# Altium schematic sheet 01. Main.SchDoc
size A3; CheckedBy: 黄钦宁; Author: 陈坤; DocumentNumber: 1; SheetNumber: 1; SheetTotal: 13; PageSetup: Record=PageOptions|CenterHorizontal=True|CenterVertical=True|PrintScale=1.00|XCorrection=1.00|YCorrection=1.00|PrintKind=0|BorderSize=5000000|LeftOffset=0|BottomOffset=0|Orientation=2|PaperLength=1000|PaperWidth=1000|Scale=100|PaperSource=7|PrintQuality=600|MediaType=1|DitherType=10|PaperKind=A4|PrintScaleMode=1; DesignDate: 2013-08-16; CheckDate: 2013-12-28; SheetName: Main; SheetVersion: V1.01; SheetDescription: EasyARM-iMX283评估底板; ModifiedDate1: 2013-11-30; ModifiedDate2: 2013-11-30; ModifiedContent1: 将悬空的引脚引到排针上; ModifiedContent2: 删除纽扣电池电路，增加锂电池插座; ProductName: EasyARM-iMX28学习套件; ProductModel: EasyARM-iMX283
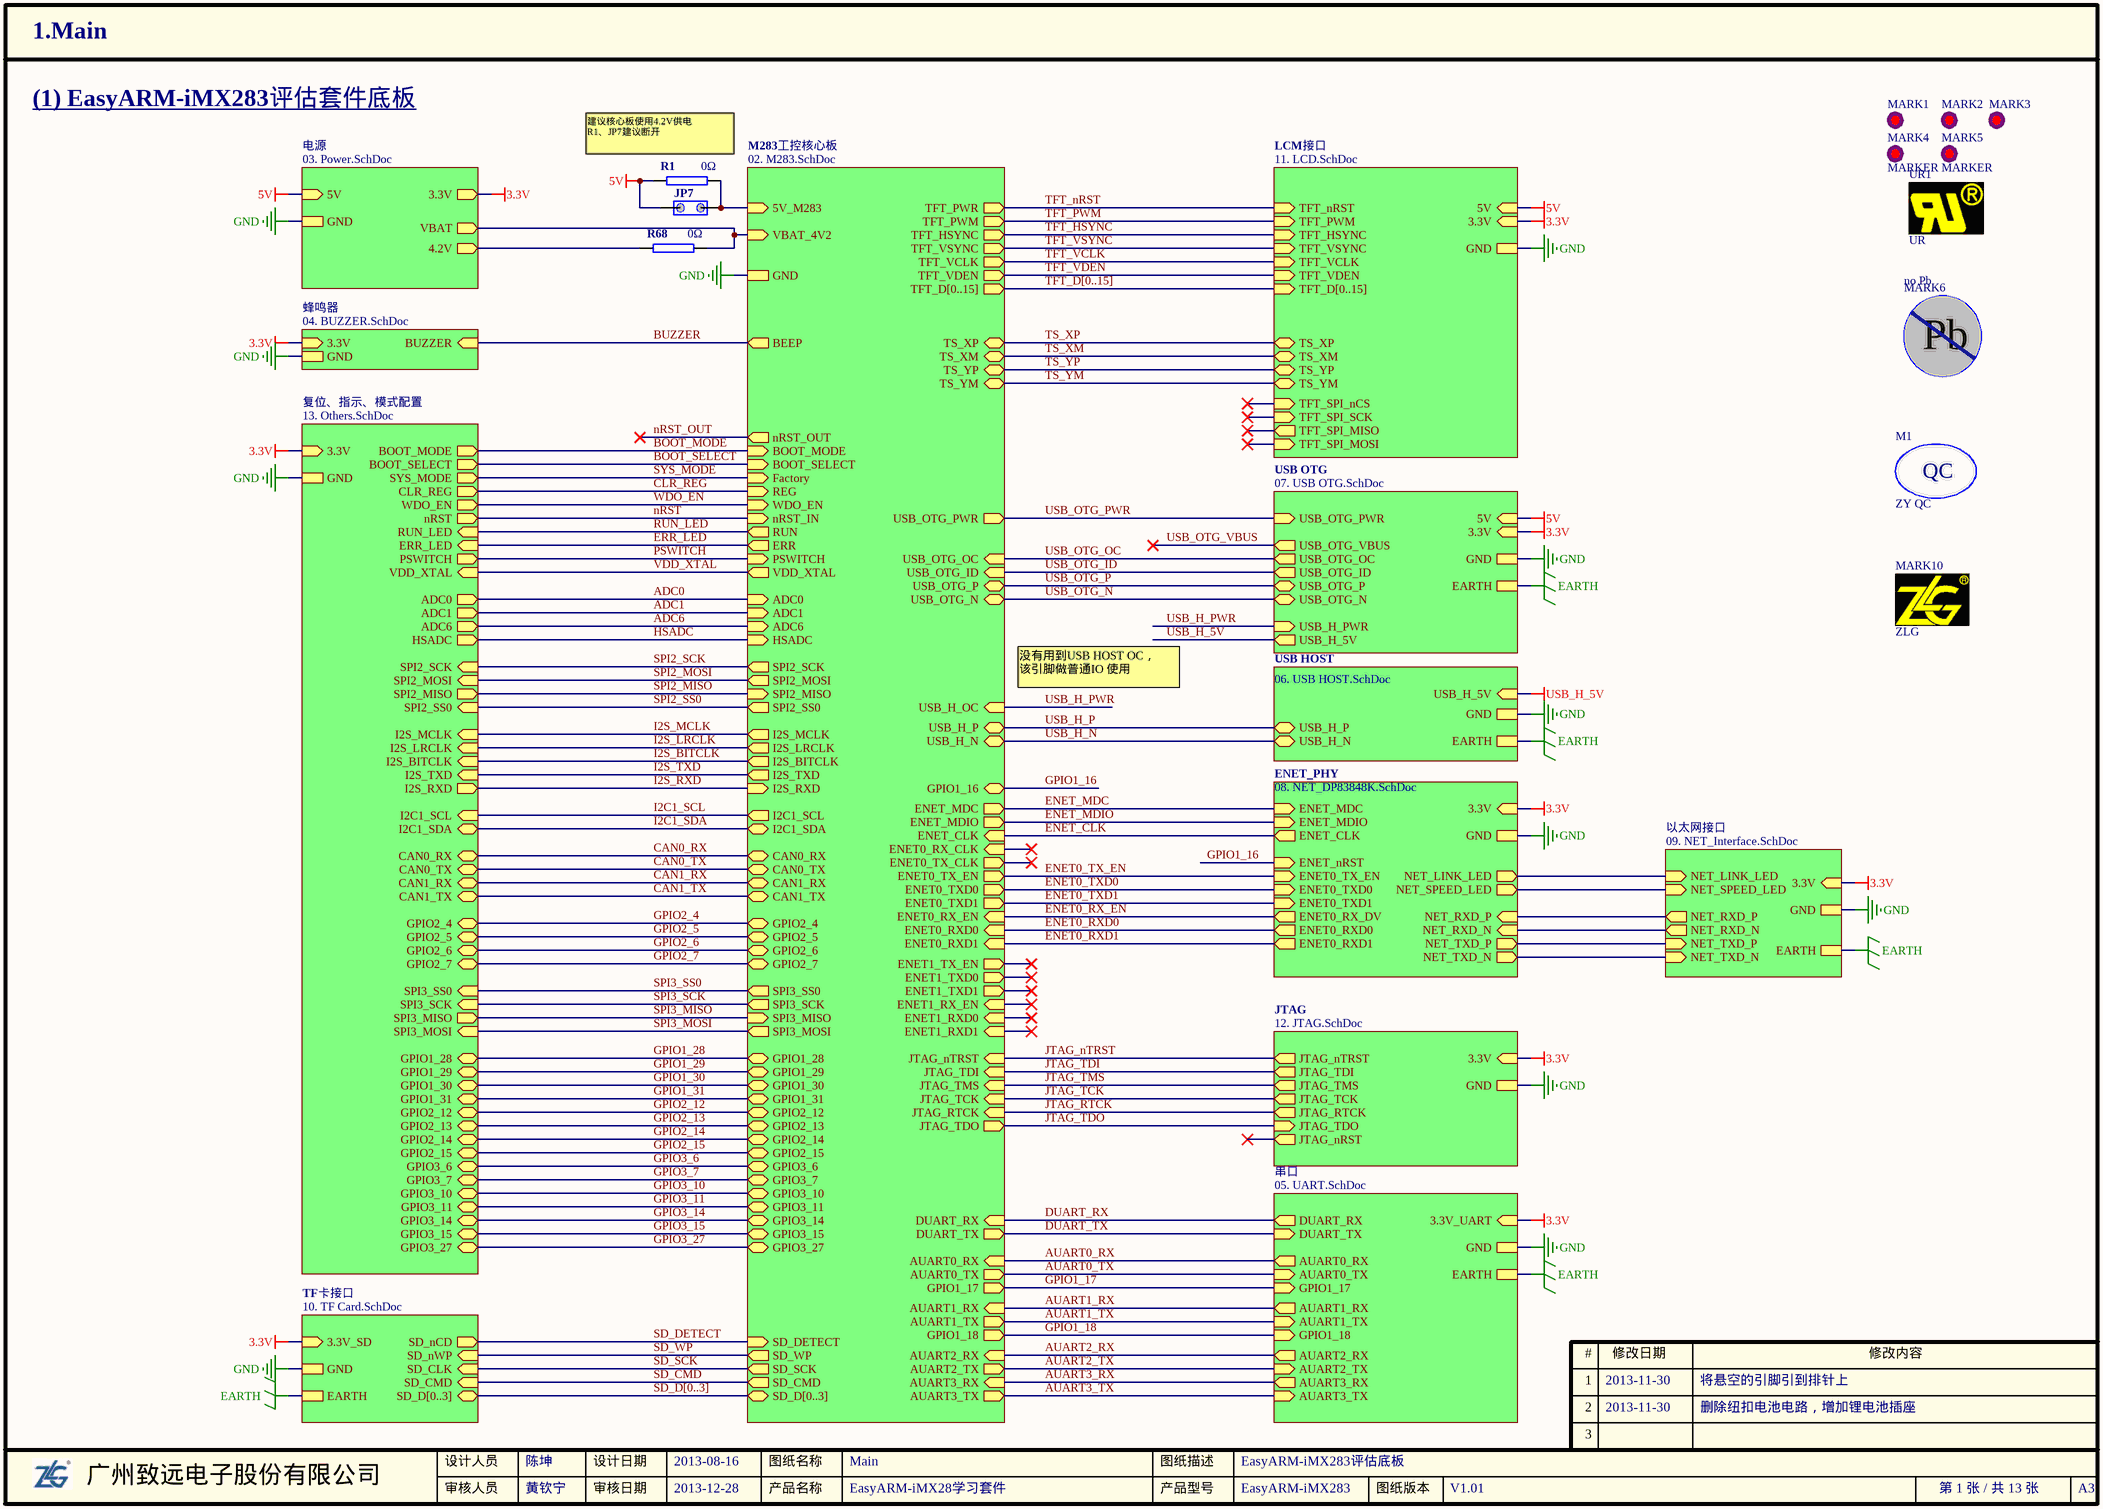
[diagram p0: 01. Main.SchDoc]

## Parts
JP7  120Ω_EN  [SIP-2]  (value not drawn)
M1  ZY QC  [ZY_QC]  (no BOM)
MARK1  MARKER  [MARKER-C]  (value not drawn)
MARK2  MARKER  [MARKER-C]  (value not drawn)
MARK3  MARKER  [MARKER-C]  (value not drawn)
MARK4  MARKER  [MARKER-C]
MARK5  MARKER  [MARKER-C]
MARK6  no Pb  [ZY_no Pb-4]
MARK10  ZLG  [ZLG0.7]  (no BOM)
R1  0Ω  [0603R]
R68  0Ω  [0603R]
UR1  UR  [ZY_UR-3X2]

## Sub-sheets
ENET_PHY = 08. NET_DP83848K.SchDoc: 3.3V, NET_LINK_LED (out), NET_SPEED_LED (out), NET_RXD_P (in), NET_RXD_N (in), GND, NET_TXD_P (out), NET_TXD_N (out), ENET_nRST (in), ENET_MDC (in), ENET_MDIO (in), ENET0_TX_EN (in), ENET0_RX_DV (out), ENET_CLK (out), ENET0_TXD0 (in), ENET0_TXD1 (in), ENET0_RXD0 (out), ENET0_RXD1 (out)
JTAG = 12. JTAG.SchDoc: 3.3V, GND, JTAG_nTRST (out), JTAG_TDI (out), JTAG_TMS (out), JTAG_TCK (out), JTAG_RTCK (out), JTAG_TDO (in), JTAG_nRST (out)
LCM接口 = 11. LCD.SchDoc: 5V, 3.3V, GND, TS_XP (bidir), TS_XM (bidir), TS_YP (bidir), TS_YM (bidir), TFT_D[0..15] (in), TFT_PWM (in), TFT_HSYNC (in), TFT_VSYNC (in), TFT_VCLK (in), TFT_VDEN (in), TFT_SPI_MISO (out), TFT_SPI_MOSI (in), TFT_SPI_nCS (in), TFT_SPI_SCK (in), TFT_nRST (in)
M283工控核心板 = 02. M283.SchDoc: 5V_M283, GND, Factory (in), BOOT_MODE (in), BOOT_SELECT (in), WDO_EN (in), nRST_IN (in), nRST_OUT (out), RUN (out), ERR (out), BEEP (out), SD_DETECT (in), SD_SCK (out), SD_WP (out), SD_D[0..3] (bidir), SD_CMD (out), DUART_RX (in), DUART_TX (out), TFT_VSYNC (out), TFT_HSYNC (out), TFT_VCLK (out), TFT_VDEN (out), TFT_PWM (out), TFT_D[0..15] (out), TS_XP (bidir), TS_XM (bidir), TS_YP (bidir), TS_YM (bidir), ADC0 (in), ADC1 (in), ADC6 (in), HSADC (in), USB_H_N (bidir), USB_H_P (bidir), USB_OTG_OC (in), USB_OTG_ID (in), USB_OTG_P (bidir), USB_OTG_N (bidir), SPI2_MOSI (out), SPI2_MISO (in), SPI2_SCK (out), SPI2_SS0 (out), JTAG_TCK (in), JTAG_TMS (in), JTAG_TDI (in), JTAG_TDO (out), JTAG_RTCK (in), JTAG_nTRST (in), REG (in), VBAT_4V2 (in), PSWITCH (in), I2S_BITCLK (out), I2S_LRCLK (out), I2S_MCLK (out), I2S_TXD (out), I2S_RXD (in), I2C1_SCL (out), I2C1_SDA (bidir), CAN0_RX (bidir), CAN0_TX (bidir), CAN1_RX (bidir), CAN1_TX (bidir), AUART0_TX (out), AUART0_RX (in), AUART1_RX (in), AUART1_TX (out), GPIO1_17 (out), AUART2_RX (in), AUART2_TX (out), GPIO1_18 (out), AUART3_RX (in), AUART3_TX (out), USB_H_OC (in), USB_OTG_PWR (out), SPI3_MISO (in), SPI3_MOSI (out), SPI3_SCK (out), SPI3_SS0 (out), ENET_MDC (out), ENET_MDIO (out), ENET0_TX_CLK (out), ENET0_TX_EN (out), ENET0_RX_EN (in), ENET0_RX_CLK (in), VDD_XTAL (out), TFT_PWR (out), GPIO3_6 (bidir), GPIO3_7 (bidir), GPIO3_10 (bidir), GPIO3_11 (bidir), GPIO3_14 (bidir), GPIO3_15 (bidir), GPIO3_27 (bidir), GPIO2_12 (bidir), GPIO2_13 (bidir), GPIO2_14 (bidir), GPIO2_15 (bidir), ENET_CLK (in), GPIO1_28 (bidir), GPIO1_29 (bidir), GPIO1_30 (bidir), GPIO1_31 (bidir), GPIO1_16 (bidir), ENET0_TXD0 (out), ENET0_TXD1 (out), ENET0_RXD0 (in), ENET0_RXD1 (in), GPIO2_4 (bidir), GPIO2_5 (bidir), GPIO2_6 (bidir), GPIO2_7 (bidir), ENET1_TX_EN (out), ENET1_RX_EN (in), ENET1_TXD0 (out), ENET1_TXD1 (out), ENET1_RXD0 (in), ENET1_RXD1 (in)
TF卡接口 = 10. TF Card.SchDoc: 3.3V_SD, GND, SD_nCD (out), SD_nWP (in), SD_CLK (in), SD_CMD (in), EARTH, SD_D[0..3] (bidir)
USB HOST = 06. USB HOST.SchDoc: USB_H_5V, GND, USB_H_P (bidir), USB_H_N (bidir), EARTH
USB OTG = 07. USB OTG.SchDoc: 5V, GND, USB_OTG_PWR (in), USB_OTG_ID (out), USB_OTG_P (bidir), USB_OTG_N (bidir), EARTH, USB_OTG_OC (out), USB_OTG_VBUS (out), USB_H_PWR (in), USB_H_5V (out), 3.3V (in)
串口 = 05. UART.SchDoc: 3.3V_UART (in), GND, DUART_RX (out), DUART_TX (in), EARTH, AUART0_RX (out), AUART0_TX (in), AUART1_RX (out), AUART1_TX (in), GPIO1_17 (in), GPIO1_18 (in), AUART2_RX (out), AUART3_RX (out), AUART3_TX (in), AUART2_TX (in)
以太网接口 = 09. NET_Interface.SchDoc: 3.3V (in), GND, NET_LINK_LED (in), NET_SPEED_LED (in), NET_RXD_P (out), NET_RXD_N (out), EARTH, NET_TXD_P (in), NET_TXD_N (in)
复位、指示、模式配置 = 13. Others.SchDoc: 3.3V, GND, BOOT_MODE (out), BOOT_SELECT (out), SYS_MODE (out), WDO_EN (out), nRST (out), RUN_LED (in), ERR_LED (in), ADC0 (out), ADC1 (out), ADC6 (out), HSADC (out), SPI2_SCK (in), SPI2_MOSI (in), SPI2_MISO (out), SPI2_SS0 (in), CLR_REG (out), PSWITCH (out), I2S_BITCLK (in), I2S_MCLK (in), I2S_LRCLK (in), I2S_TXD (in), I2S_RXD (out), I2C1_SCL (in), I2C1_SDA (bidir), VDD_XTAL (in), GPIO2_4 (bidir), GPIO2_5 (bidir), GPIO2_6 (bidir), GPIO2_7 (bidir), CAN0_RX (bidir), CAN0_TX (bidir), CAN1_RX (bidir), CAN1_TX (bidir), SPI3_SCK (in), SPI3_MOSI (in), SPI3_MISO (out), SPI3_SS0 (in), GPIO3_6 (bidir), GPIO3_7 (bidir), GPIO3_10 (bidir), GPIO3_11 (bidir), GPIO3_14 (bidir), GPIO3_15 (bidir), GPIO3_27 (bidir), GPIO2_12 (bidir), GPIO2_13 (bidir), GPIO2_14 (bidir), GPIO2_15 (bidir), GPIO1_28 (bidir), GPIO1_29 (bidir), GPIO1_30 (bidir), GPIO1_31 (bidir)
电源 = 03. Power.SchDoc: 3.3V, GND, 5V, VBAT (out), 4.2V (out)
蜂鸣器 = 04. BUZZER.SchDoc: 3.3V (in), BUZZER (in), GND

## Nets
3.3V: sheet 串口/3.3V_UART, sheet USB OTG/3.3V, sheet 以太网接口/3.3V, sheet ENET_PHY/3.3V, sheet TF卡接口/3.3V_SD, sheet LCM接口/3.3V, sheet 电源/3.3V, sheet 复位、指示、模式配置/3.3V, sheet JTAG/3.3V, sheet 蜂鸣器/3.3V
5V: JP7.1 R1.1 ; sheet USB OTG/5V, sheet LCM接口/5V, sheet 电源/5V
EARTH: sheet 串口/EARTH, sheet USB OTG/EARTH, sheet USB HOST/EARTH, sheet 以太网接口/EARTH, sheet TF卡接口/EARTH
GND: sheet M283工控核心板/GND, sheet 串口/GND, sheet USB OTG/GND, sheet USB HOST/GND, sheet 以太网接口/GND, sheet ENET_PHY/GND, sheet TF卡接口/GND, sheet LCM接口/GND, sheet 电源/GND, sheet 复位、指示、模式配置/GND, sheet JTAG/GND, sheet 蜂鸣器/GND
USB_H_5V: sheet USB OTG/USB_H_5V, sheet USB HOST/USB_H_5V
ADC0: sheet M283工控核心板/ADC0, sheet 复位、指示、模式配置/ADC0
ADC1: sheet M283工控核心板/ADC1, sheet 复位、指示、模式配置/ADC1
ADC6: sheet M283工控核心板/ADC6, sheet 复位、指示、模式配置/ADC6
AUART0_RX: sheet M283工控核心板/AUART0_RX, sheet 串口/AUART0_RX
AUART0_TX: sheet M283工控核心板/AUART0_TX, sheet 串口/AUART0_TX
AUART1_RX: sheet M283工控核心板/AUART1_RX, sheet 串口/AUART1_RX
AUART1_TX: sheet M283工控核心板/AUART1_TX, sheet 串口/AUART1_TX
AUART2_RX: sheet M283工控核心板/AUART2_RX, sheet 串口/AUART2_RX
AUART2_TX: sheet M283工控核心板/AUART2_TX, sheet 串口/AUART2_TX
AUART3_RX: sheet M283工控核心板/AUART3_RX, sheet 串口/AUART3_RX
AUART3_TX: sheet M283工控核心板/AUART3_TX, sheet 串口/AUART3_TX
BOOT_MODE: sheet M283工控核心板/BOOT_MODE, sheet 复位、指示、模式配置/BOOT_MODE
BOOT_SELECT: sheet M283工控核心板/BOOT_SELECT, sheet 复位、指示、模式配置/BOOT_SELECT
BUZZER: sheet M283工控核心板/BEEP, sheet 蜂鸣器/BUZZER
CAN0_RX: sheet M283工控核心板/CAN0_RX, sheet 复位、指示、模式配置/CAN0_RX
CAN0_TX: sheet M283工控核心板/CAN0_TX, sheet 复位、指示、模式配置/CAN0_TX
CAN1_RX: sheet M283工控核心板/CAN1_RX, sheet 复位、指示、模式配置/CAN1_RX
CAN1_TX: sheet M283工控核心板/CAN1_TX, sheet 复位、指示、模式配置/CAN1_TX
CLR_REG: sheet M283工控核心板/REG, sheet 复位、指示、模式配置/CLR_REG
DUART_RX: sheet M283工控核心板/DUART_RX, sheet 串口/DUART_RX
DUART_TX: sheet M283工控核心板/DUART_TX, sheet 串口/DUART_TX
ENET0_RX_EN: sheet M283工控核心板/ENET0_RX_EN, sheet ENET_PHY/ENET0_RX_DV
ENET0_RXD0: sheet M283工控核心板/ENET0_RXD0, sheet ENET_PHY/ENET0_RXD0
ENET0_RXD1: sheet M283工控核心板/ENET0_RXD1, sheet ENET_PHY/ENET0_RXD1
ENET0_TX_EN: sheet M283工控核心板/ENET0_TX_EN, sheet ENET_PHY/ENET0_TX_EN
ENET0_TXD0: sheet M283工控核心板/ENET0_TXD0, sheet ENET_PHY/ENET0_TXD0
ENET0_TXD1: sheet M283工控核心板/ENET0_TXD1, sheet ENET_PHY/ENET0_TXD1
ENET_CLK: sheet M283工控核心板/ENET_CLK, sheet ENET_PHY/ENET_CLK
ENET_MDC: sheet M283工控核心板/ENET_MDC, sheet ENET_PHY/ENET_MDC
ENET_MDIO: sheet M283工控核心板/ENET_MDIO, sheet ENET_PHY/ENET_MDIO
ERR_LED: sheet M283工控核心板/ERR, sheet 复位、指示、模式配置/ERR_LED
GPIO1_16: sheet M283工控核心板/GPIO1_16, sheet ENET_PHY/ENET_nRST
GPIO1_17: sheet M283工控核心板/GPIO1_17, sheet 串口/GPIO1_17
GPIO1_18: sheet M283工控核心板/GPIO1_18, sheet 串口/GPIO1_18
GPIO1_28: sheet M283工控核心板/GPIO1_28, sheet 复位、指示、模式配置/GPIO1_28
GPIO1_29: sheet M283工控核心板/GPIO1_29, sheet 复位、指示、模式配置/GPIO1_29
GPIO1_30: sheet M283工控核心板/GPIO1_30, sheet 复位、指示、模式配置/GPIO1_30
GPIO1_31: sheet M283工控核心板/GPIO1_31, sheet 复位、指示、模式配置/GPIO1_31
GPIO2_4: sheet M283工控核心板/GPIO2_4, sheet 复位、指示、模式配置/GPIO2_4
GPIO2_5: sheet M283工控核心板/GPIO2_5, sheet 复位、指示、模式配置/GPIO2_5
GPIO2_6: sheet M283工控核心板/GPIO2_6, sheet 复位、指示、模式配置/GPIO2_6
GPIO2_7: sheet M283工控核心板/GPIO2_7, sheet 复位、指示、模式配置/GPIO2_7
GPIO2_12: sheet M283工控核心板/GPIO2_12, sheet 复位、指示、模式配置/GPIO2_12
GPIO2_13: sheet M283工控核心板/GPIO2_13, sheet 复位、指示、模式配置/GPIO2_13
GPIO2_14: sheet M283工控核心板/GPIO2_14, sheet 复位、指示、模式配置/GPIO2_14
GPIO2_15: sheet M283工控核心板/GPIO2_15, sheet 复位、指示、模式配置/GPIO2_15
GPIO3_6: sheet M283工控核心板/GPIO3_6, sheet 复位、指示、模式配置/GPIO3_6
GPIO3_7: sheet M283工控核心板/GPIO3_7, sheet 复位、指示、模式配置/GPIO3_7
GPIO3_10: sheet M283工控核心板/GPIO3_10, sheet 复位、指示、模式配置/GPIO3_10
GPIO3_11: sheet M283工控核心板/GPIO3_11, sheet 复位、指示、模式配置/GPIO3_11
GPIO3_14: sheet M283工控核心板/GPIO3_14, sheet 复位、指示、模式配置/GPIO3_14
GPIO3_15: sheet M283工控核心板/GPIO3_15, sheet 复位、指示、模式配置/GPIO3_15
GPIO3_27: sheet M283工控核心板/GPIO3_27, sheet 复位、指示、模式配置/GPIO3_27
HSADC: sheet M283工控核心板/HSADC, sheet 复位、指示、模式配置/HSADC
I2C1_SCL: sheet M283工控核心板/I2C1_SCL, sheet 复位、指示、模式配置/I2C1_SCL
I2C1_SDA: sheet M283工控核心板/I2C1_SDA, sheet 复位、指示、模式配置/I2C1_SDA
I2S_BITCLK: sheet M283工控核心板/I2S_BITCLK, sheet 复位、指示、模式配置/I2S_BITCLK
I2S_LRCLK: sheet M283工控核心板/I2S_LRCLK, sheet 复位、指示、模式配置/I2S_LRCLK
I2S_MCLK: sheet M283工控核心板/I2S_MCLK, sheet 复位、指示、模式配置/I2S_MCLK
I2S_RXD: sheet M283工控核心板/I2S_RXD, sheet 复位、指示、模式配置/I2S_RXD
I2S_TXD: sheet M283工控核心板/I2S_TXD, sheet 复位、指示、模式配置/I2S_TXD
JTAG_nTRST: sheet M283工控核心板/JTAG_nTRST, sheet JTAG/JTAG_nTRST
JTAG_RTCK: sheet M283工控核心板/JTAG_RTCK, sheet JTAG/JTAG_RTCK
JTAG_TCK: sheet M283工控核心板/JTAG_TCK, sheet JTAG/JTAG_TCK
JTAG_TDI: sheet M283工控核心板/JTAG_TDI, sheet JTAG/JTAG_TDI
JTAG_TDO: sheet M283工控核心板/JTAG_TDO, sheet JTAG/JTAG_TDO
JTAG_TMS: sheet M283工控核心板/JTAG_TMS, sheet JTAG/JTAG_TMS
nRST: sheet M283工控核心板/nRST_IN, sheet 复位、指示、模式配置/nRST
nRST_OUT: sheet M283工控核心板/nRST_OUT
PSWITCH: sheet M283工控核心板/PSWITCH, sheet 复位、指示、模式配置/PSWITCH
RUN_LED: sheet M283工控核心板/RUN, sheet 复位、指示、模式配置/RUN_LED
SD_CMD: sheet M283工控核心板/SD_CMD, sheet TF卡接口/SD_CMD
SD_DETECT: sheet M283工控核心板/SD_DETECT, sheet TF卡接口/SD_nCD
SD_SCK: sheet M283工控核心板/SD_SCK, sheet TF卡接口/SD_CLK
SD_WP: sheet M283工控核心板/SD_WP, sheet TF卡接口/SD_nWP
SPI2_MISO: sheet M283工控核心板/SPI2_MISO, sheet 复位、指示、模式配置/SPI2_MISO
SPI2_MOSI: sheet M283工控核心板/SPI2_MOSI, sheet 复位、指示、模式配置/SPI2_MOSI
SPI2_SCK: sheet M283工控核心板/SPI2_SCK, sheet 复位、指示、模式配置/SPI2_SCK
SPI2_SS0: sheet M283工控核心板/SPI2_SS0, sheet 复位、指示、模式配置/SPI2_SS0
SPI3_MISO: sheet M283工控核心板/SPI3_MISO, sheet 复位、指示、模式配置/SPI3_MISO
SPI3_MOSI: sheet M283工控核心板/SPI3_MOSI, sheet 复位、指示、模式配置/SPI3_MOSI
SPI3_SCK: sheet M283工控核心板/SPI3_SCK, sheet 复位、指示、模式配置/SPI3_SCK
SPI3_SS0: sheet M283工控核心板/SPI3_SS0, sheet 复位、指示、模式配置/SPI3_SS0
SYS_MODE: sheet M283工控核心板/Factory, sheet 复位、指示、模式配置/SYS_MODE
TFT_HSYNC: sheet M283工控核心板/TFT_HSYNC, sheet LCM接口/TFT_HSYNC
TFT_nRST: sheet M283工控核心板/TFT_PWR, sheet LCM接口/TFT_nRST
TFT_PWM: sheet M283工控核心板/TFT_PWM, sheet LCM接口/TFT_PWM
TFT_VCLK: sheet M283工控核心板/TFT_VCLK, sheet LCM接口/TFT_VCLK
TFT_VDEN: sheet M283工控核心板/TFT_VDEN, sheet LCM接口/TFT_VDEN
TFT_VSYNC: sheet M283工控核心板/TFT_VSYNC, sheet LCM接口/TFT_VSYNC
TS_XM: sheet M283工控核心板/TS_XM, sheet LCM接口/TS_XM
TS_XP: sheet M283工控核心板/TS_XP, sheet LCM接口/TS_XP
TS_YM: sheet M283工控核心板/TS_YM, sheet LCM接口/TS_YM
TS_YP: sheet M283工控核心板/TS_YP, sheet LCM接口/TS_YP
USB_H_N: sheet M283工控核心板/USB_H_N, sheet USB HOST/USB_H_N
USB_H_P: sheet M283工控核心板/USB_H_P, sheet USB HOST/USB_H_P
USB_H_PWR: sheet M283工控核心板/USB_H_OC, sheet USB OTG/USB_H_PWR
USB_OTG_ID: sheet M283工控核心板/USB_OTG_ID, sheet USB OTG/USB_OTG_ID
USB_OTG_N: sheet M283工控核心板/USB_OTG_N, sheet USB OTG/USB_OTG_N
USB_OTG_OC: sheet M283工控核心板/USB_OTG_OC, sheet USB OTG/USB_OTG_OC
USB_OTG_P: sheet M283工控核心板/USB_OTG_P, sheet USB OTG/USB_OTG_P
USB_OTG_PWR: sheet M283工控核心板/USB_OTG_PWR, sheet USB OTG/USB_OTG_PWR
USB_OTG_VBUS: sheet USB OTG/USB_OTG_VBUS
VDD_XTAL: sheet M283工控核心板/VDD_XTAL, sheet 复位、指示、模式配置/VDD_XTAL
WDO_EN: sheet M283工控核心板/WDO_EN, sheet 复位、指示、模式配置/WDO_EN
NetJP7_2: JP7.2 R1.2 ; sheet M283工控核心板/5V_M283
NetR68_1: R68.1 ; sheet 电源/4.2V
NetR68_2: R68.2 ; sheet M283工控核心板/VBAT_4V2, sheet 电源/VBAT
(unnamed): sheet 以太网接口/NET_LINK_LED, sheet ENET_PHY/NET_LINK_LED
(unnamed): sheet 以太网接口/NET_SPEED_LED, sheet ENET_PHY/NET_SPEED_LED
(unnamed): sheet 以太网接口/NET_RXD_P, sheet ENET_PHY/NET_RXD_P
(unnamed): sheet 以太网接口/NET_RXD_N, sheet ENET_PHY/NET_RXD_N
(unnamed): sheet 以太网接口/NET_TXD_P, sheet ENET_PHY/NET_TXD_P
(unnamed): sheet 以太网接口/NET_TXD_N, sheet ENET_PHY/NET_TXD_N

Not connected (* = marked no-connect by the designer): MARK1 0; MARK2 0; MARK3 0; MARK4 0; MARK5 0

## Buses and harness runs
bus SD_D[0..3] = sheet M283工控核心板/SD_D[0..3] = sheet TF卡接口/SD_D[0..3]
bus TFT_D[0..15] = sheet LCM接口/TFT_D[0..15] = sheet M283工控核心板/TFT_D[0..15]

## Notes on the sheet
- (1) EasyARM-iMX283评估套件底板
- (near R1) 建议核心板使用4.2V供电
  R1、JP7建议断开
- 没有用到USB HOST OC，
  该引脚做普通IO 使用
- 1
- #
- 修改日期
- 修改内容
- 2
- 3
- 广州致远电子股份有限公司
- 设计人员
- 审核人员
- 设计日期
- 审核日期
- 产品名称
- 图纸名称
- 产品型号
- 图纸描述
- 图纸版本
- A3
- (in symbol no Pb) Pb
- (in symbol ZY QC) QC

## Library data of the parts
JP7 = JMP2
R1 R68 = 1.01.01.0001: 0Ω,0603,*,RoHS; 名称: 电阻; 封装: 0603; 设备封装名称: R0603_0R; 贴片和直插: SMT; 器件优选方案: 优先选用; 物料代码: 1.01.01.0001; Value: 0Ω; 厂商: *; RoHS: RoHS; 型号: 0Ω; ComponentLink1Description: ErpDataInfo; ComponentLink1URL: http://erp.zlgmcu.com/ErpExt/ErpData/ListMateriel.aspx?pkey=1.01.01.0001